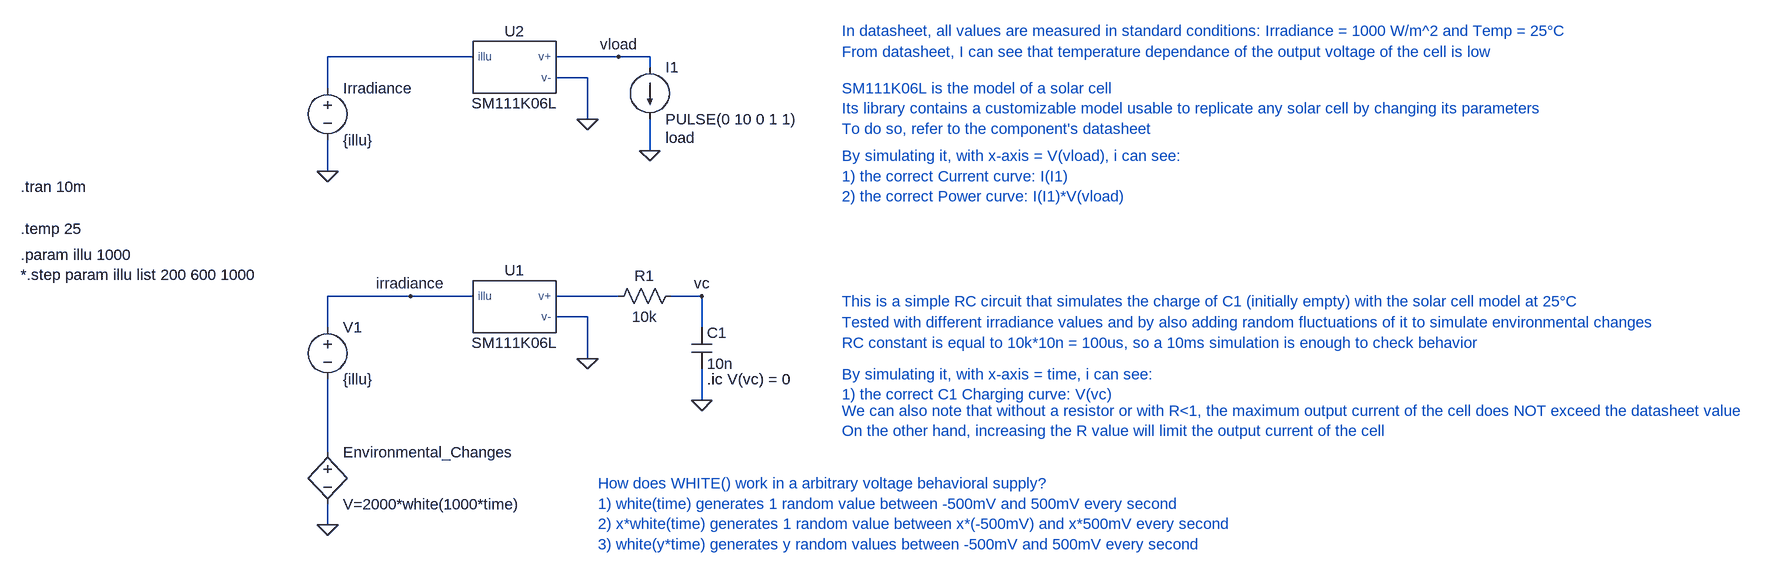
[diagram p0: schematic solarcell_test.asc]
solarcell_test.asc, the LTspice schematic file:
Version 4.1
SHEET 1 2000 1056
WIRE -1008 48 -1232 48
WIRE -784 48 -880 48
WIRE -736 48 -784 48
WIRE -736 64 -736 48
WIRE -832 80 -880 80
WIRE -1232 96 -1232 48
WIRE -832 144 -832 80
WIRE -736 192 -736 144
WIRE -1232 224 -1232 176
WIRE -1104 416 -1232 416
WIRE -1008 416 -1104 416
WIRE -784 416 -880 416
WIRE -656 416 -704 416
WIRE -832 448 -880 448
WIRE -1232 464 -1232 416
WIRE -656 464 -656 416
WIRE -832 512 -832 448
WIRE -656 576 -656 528
WIRE -1232 656 -1232 544
WIRE -1232 768 -1232 736
FLAG -832 512 0
FLAG -656 416 vc
FLAG -656 576 0
FLAG -1232 768 0
FLAG -832 144 0
FLAG -736 192 0
FLAG -784 48 vload
FLAG -1232 224 0
FLAG -1104 416 irradiance
SYMBOL SM111K06L -944 432 R0
SYMATTR InstName U1
SYMBOL voltage -1232 448 R0
SYMATTR InstName V1
SYMATTR Value {illu}
SYMBOL cap -672 464 R0
SYMATTR InstName C1
SYMATTR Value 10n
SYMBOL bv -1232 640 R0
SYMATTR InstName Environmental_Changes
SYMATTR Value V=2000*white(1000*time)
SYMBOL voltage -1232 80 R0
SYMATTR InstName Irradiance
SYMATTR Value {illu}
SYMBOL SM111K06L -944 64 R0
SYMATTR InstName U2
SYMBOL current -736 64 R0
WINDOW 123 0 0 Left 0
WINDOW 39 24 108 Left 2
SYMATTR SpiceLine load
SYMATTR InstName I1
SYMATTR Value PULSE(0 10 0 1 1)
SYMBOL res -800 432 R270
WINDOW 0 32 56 VTop 2
WINDOW 3 0 56 VBottom 2
SYMATTR InstName R1
SYMATTR Value 10k
TEXT -1704 352 Left 2 !.param illu 1000\n*.step param illu list 200 600 1000
TEXT -1704 248 Left 2 !.tran 10m
TEXT -1704 312 Left 2 !.temp 25
TEXT -648 544 Left 2 !.ic V(vc) = 0
TEXT -440 8 Left 2 ;In datasheet, all values are measured in standard conditions: Irradiance = 1000 W/m^2 and Temp = 25°C
TEXT -440 40 Left 2 ;From datasheet, I can see that temperature dependance of the output voltage of the cell is low
TEXT -440 424 Left 2 ;This is a simple RC circuit that simulates the charge of C1 (initially empty) with the solar cell model at 25°C
TEXT -440 456 Left 2 ;Tested with different irradiance values and by also adding random fluctuations of it to simulate environmental changes
TEXT -440 488 Left 2 ;RC constant is equal to 10k*10n = 100us, so a 10ms simulation is enough to check behavior
TEXT -816 704 Left 2 ;How does WHITE() work in a arbitrary voltage behavioral supply? \n1) white(time) generates 1 random value between -500mV and 500mV every second\n2) x*white(time) generates 1 random value between x*(-500mV) and x*500mV every second\n3) white(y*time) generates y random values between -500mV and 500mV every second
TEXT -440 96 Left 2 ;SM111K06L is the model of a solar cell\nIts library contains a customizable model usable to replicate any solar cell by changing its parameters\nTo do so, refer to the component's datasheet
TEXT -440 200 Left 2 ;By simulating it, with x-axis = V(vload), i can see:\n1) the correct Current curve: I(I1)\n2) the correct Power curve: I(I1)*V(vload)
TEXT -440 536 Left 2 ;By simulating it, with x-axis = time, i can see:\n1) the correct C1 Charging curve: V(vc)
TEXT -440 592 Left 2 ;We can also note that without a resistor or with R<1, the maximum output current of the cell does NOT exceed the datasheet value\nOn the other hand, increasing the R value will limit the output current of the cell

The netlist it stands for:
* solarcell_test.asc
X§U1 N002 0 irradiance SM111K06L  ; pins v+ v- illu
V1 irradiance N003 {illu}
C1 vc 0 10n
B§Environmental_Changes N003 0 V=2000*white(1000*time)
V§Irradiance N001 0 {illu}
X§U2 vload 0 N001 SM111K06L  ; pins v+ v- illu
I1 vload 0 PULSE(0 10 0 1 1) load
R1 N002 vc 10k
.param illu 1000
*.step param illu list 200 600 1000
.tran 10m
.temp 25
.ic V(vc) = 0
* In datasheet, all values are measured in standard conditions: Irradiance = 1000 W/m^2 and Temp = 25°C
* From datasheet, I can see that temperature dependance of the output voltage of the cell is low
* This is a simple RC circuit that simulates the charge of C1 (initially empty) with the solar cell model at 25°C
* Tested with different irradiance values and by also adding random fluctuations of it to simulate environmental changes
* RC constant is equal to 10k*10n = 100us, so a 10ms simulation is enough to check behavior
* How does WHITE() work in a arbitrary voltage behavioral supply?
* 1) white(time) generates 1 random value between -500mV and 500mV every second
* 2) x*white(time) generates 1 random value between x*(-500mV) and x*500mV every second
* 3) white(y*time) generates y random values between -500mV and 500mV every second
* SM111K06L is the model of a solar cell
* Its library contains a customizable model usable to replicate any solar cell by changing its parameters
* To do so, refer to the component's datasheet
* By simulating it, with x-axis = V(vload), i can see:
* 1) the correct Current curve: I(I1)
* 2) the correct Power curve: I(I1)*V(vload)
* By simulating it, with x-axis = time, i can see:
* 1) the correct C1 Charging curve: V(vc)
* We can also note that without a resistor or with R<1, the maximum output current of the cell does NOT exceed the datasheet value
* On the other hand, increasing the R value will limit the output current of the cell
.lib C:\Users\sakba\Desktop\UNITN\Tesi\esperimenti\solarcell\02_library_Complex.txt
.backanno
.end

* Results of the author's LTspice run, read from the files saved beside the schematic
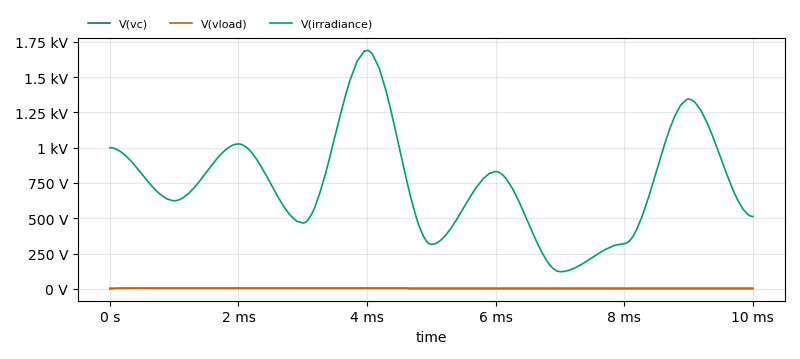
[diagram p1: Transient Analysis of solarcell_test.asc, plotted from the saved traces]
* Transient Analysis, 1 run:
*   V(vc): min 0 V, max 4.25 V, average 4.018 V, rms 4.029 V, last 4.027 V
*   V(vload): min 134.9 mV, max 4.148 V, average 1.938 V, rms 2.678 V, last 134.9 mV
*   V(irradiance): min 120.9 V, max 1.689 kV, average 749.1 V, rms 837.6 V, last 512 V